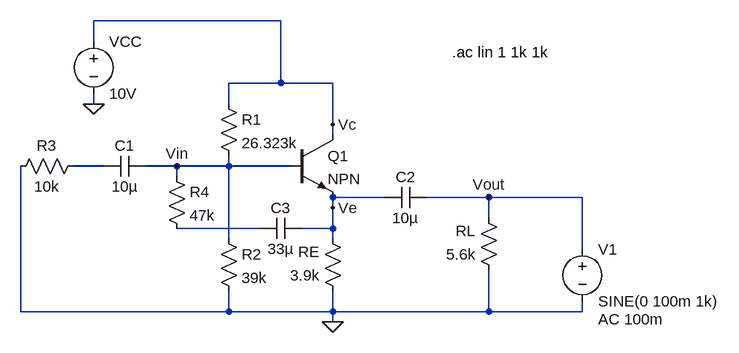
[diagram p0: schematic Bootstrapped - Rout.asc]
Bootstrapped - Rout.asc, the LTspice schematic file:
Version 4
SHEET 1 1200 680
WIRE 336 0 48 0
WIRE 48 32 48 0
WIRE 336 96 336 0
WIRE 336 96 256 96
WIRE 416 96 336 96
WIRE 48 128 48 112
WIRE 256 128 256 96
WIRE 416 160 416 96
WIRE 416 176 416 160
WIRE 64 224 16 224
WIRE 176 224 128 224
WIRE 256 224 256 208
WIRE 256 224 176 224
WIRE 352 224 256 224
WIRE 176 240 176 224
WIRE 496 272 416 272
WIRE 656 272 560 272
WIRE 800 272 656 272
WIRE 416 288 416 272
WIRE 656 304 656 272
WIRE 304 320 176 320
WIRE 416 320 416 288
WIRE 416 320 368 320
WIRE 256 336 256 224
WIRE 416 336 416 320
WIRE 800 352 800 272
WIRE -64 448 -64 224
WIRE 256 448 256 416
WIRE 256 448 -64 448
WIRE 416 448 416 416
WIRE 416 448 256 448
WIRE 656 448 656 384
WIRE 656 448 416 448
WIRE 800 448 800 432
WIRE 800 448 656 448
WIRE 416 464 416 448
FLAG 48 128 0
FLAG 656 272 Vout
FLAG 416 160 Vc
FLAG 416 288 Ve
FLAG 416 464 0
FLAG 176 224 Vin
SYMBOL voltage 48 16 R0
SYMATTR InstName VCC
SYMATTR Value 10V
SYMBOL voltage 800 336 R0
WINDOW 123 24 124 Left 2
WINDOW 39 0 0 Left 0
SYMATTR Value2 AC 100m
SYMATTR InstName V1
SYMATTR Value SINE(0 100m 1k)
SYMBOL res 240 320 R0
SYMATTR InstName R2
SYMATTR Value 39k
SYMBOL res 32 208 R90
WINDOW 0 0 56 VBottom 2
WINDOW 3 32 56 VTop 2
SYMATTR InstName R3
SYMATTR Value 10k
SYMBOL res 432 432 R180
WINDOW 0 36 76 Left 2
WINDOW 3 36 40 Left 2
SYMATTR InstName RE
SYMATTR Value 3.9k
SYMBOL res 672 400 R180
WINDOW 0 36 76 Left 2
WINDOW 3 36 40 Left 2
SYMATTR InstName RL
SYMATTR Value 5.6k
SYMBOL cap 128 208 R90
WINDOW 0 0 32 VBottom 2
WINDOW 3 32 32 VTop 2
SYMATTR InstName C1
SYMATTR Value 10µ
SYMBOL cap 560 256 R90
WINDOW 0 0 32 VBottom 2
WINDOW 3 32 32 VTop 2
SYMATTR InstName C2
SYMATTR Value 10µ
SYMBOL npn 352 176 R0
SYMATTR InstName Q1
SYMBOL res 240 112 R0
SYMATTR InstName R1
SYMATTR Value 26.323k
SYMBOL res 160 224 R0
SYMATTR InstName R4
SYMATTR Value 47k
SYMBOL cap 368 304 R90
WINDOW 0 0 32 VBottom 2
WINDOW 3 32 32 VTop 2
SYMATTR InstName C3
SYMATTR Value 33µ
TEXT 600 48 Left 2 !.ac lin 1 1k 1k

The netlist it stands for:
* Bootstrapped - Rout.asc
VCC Vc 0 10V
V1 Vout 0 SINE(0 100m 1k) AC 100m
R2 Vin 0 39k
R3 N001 0 10k
RE 0 Ve 3.9k
RL 0 Vout 5.6k
C1 Vin N001 10µ
C2 Vout Ve 10µ
Q1 Vc Vin Ve 0 NPN
R1 Vc Vin 26.323k
R4 Vin N002 47k
C3 Ve N002 33µ
.model NPN NPN
.model PNP PNP
.lib standard.bjt
.ac lin 1 1k 1k
.backanno
.end